# EAGLE schematic aqc-rev2-rear-panel (EAGLE 8.3.1)
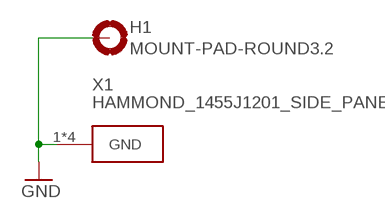
[diagram p0: schematic, sheet 1]

## Parts
H1  MOUNT-PAD-ROUND3.2  [3,2-PAD]
X1  HAMMOND_1455J1201_SIDE_PANEL  [HAMMOND_1455J1201_SIDE_PANEL]

## Nets
GND: H1.B3,2(MOUNT) X1.1(GND) X1.2(GND) X1.3(GND) X1.4(GND)

## Library data of the parts
H1 = holes:MOUNT-PAD-ROUND: MOUNTING PAD, round
X1 = meng:HAMMOND_1455J1201_SIDE_PANEL